# EAGLE design power_rev_2 (EAGLE 6.3)
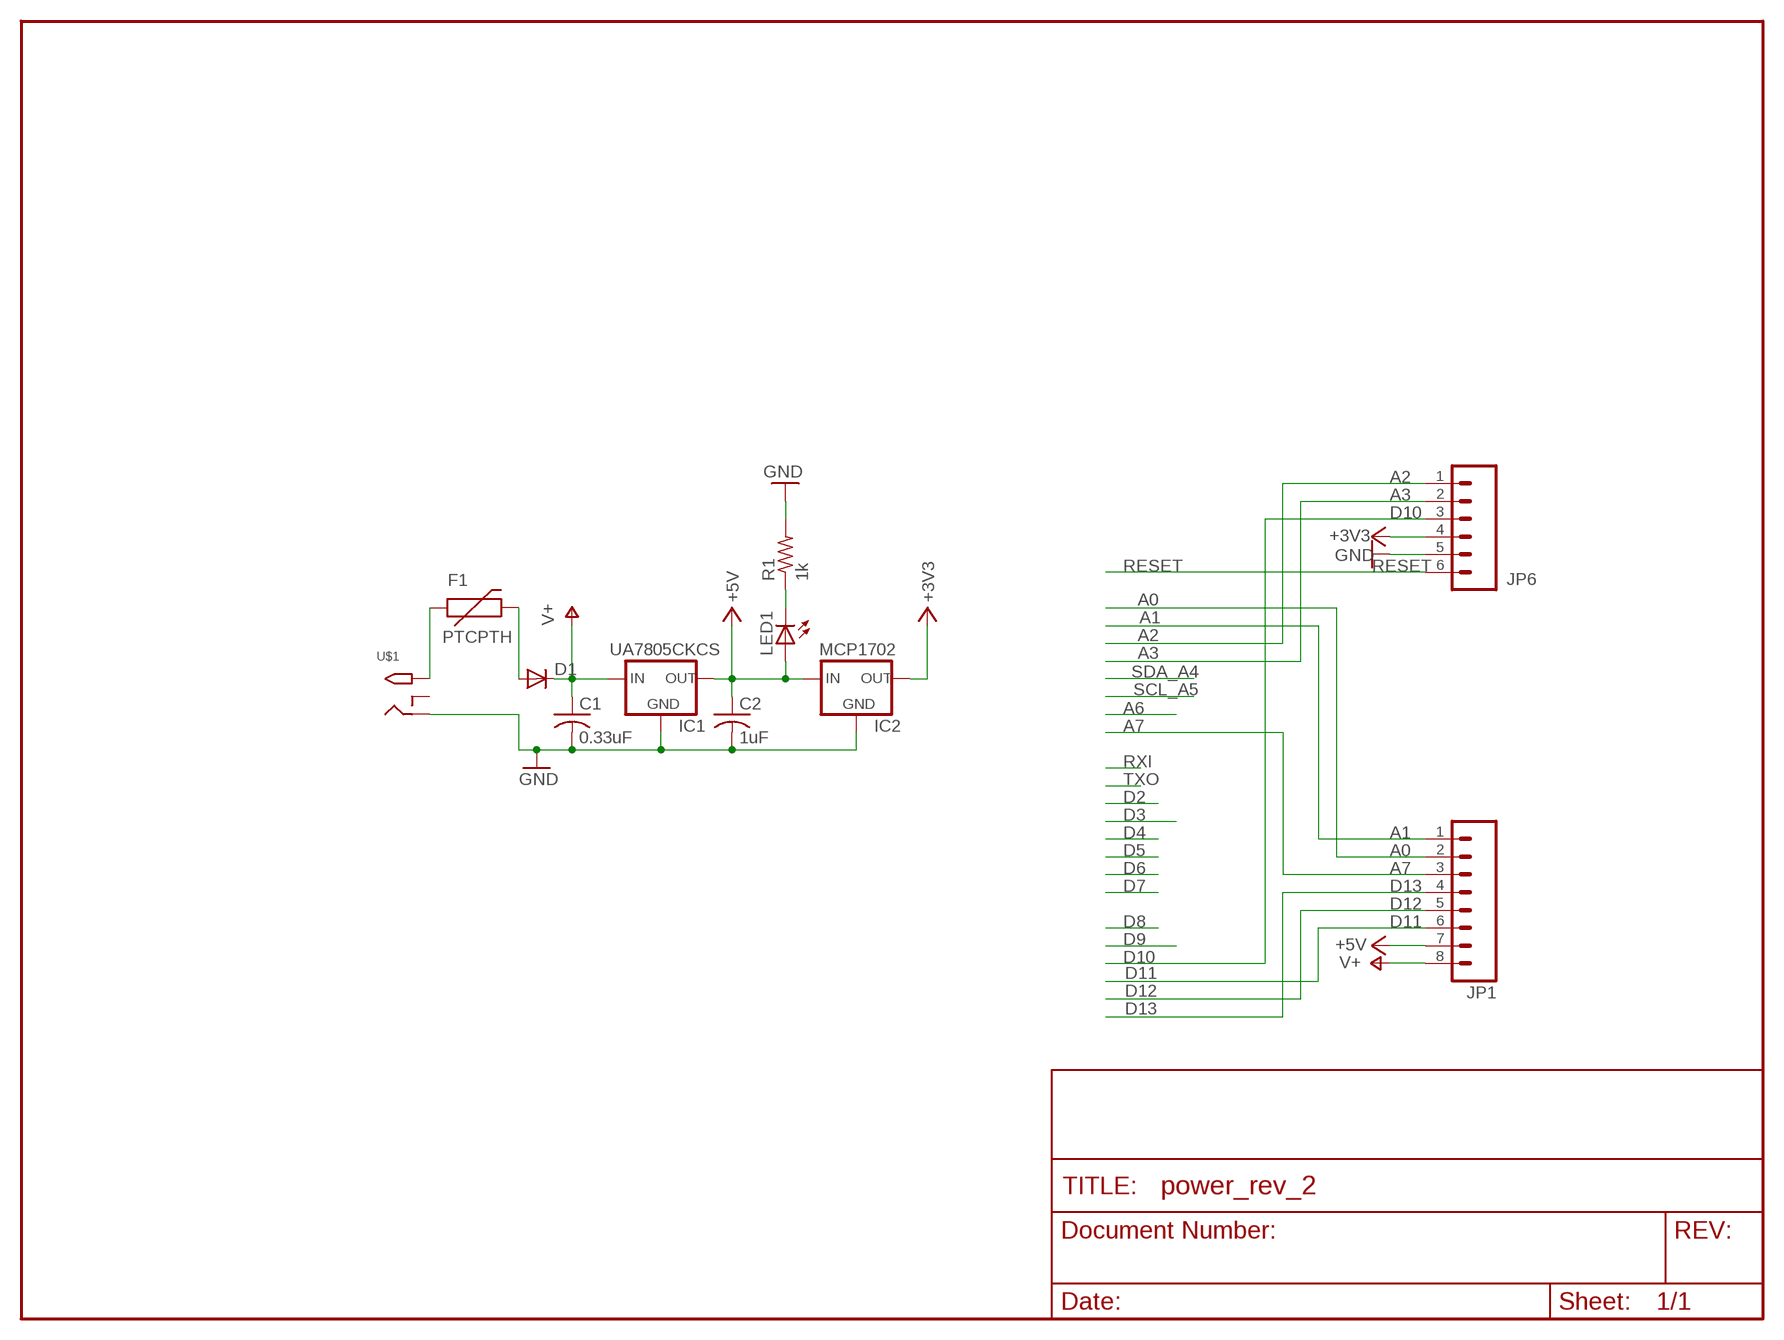
[diagram p0: schematic, sheet 1]

## Parts
C1  0.33uF  C-US025-024X044  [C025-024X044]
C2  1uF  C-US025-024X044  [C025-024X044]
D1  DIODE1N4148  [DIODE-1N4148]
F1  PTCPTH  [PTC]
IC1  UA7805CKCS  V_REG_78XX-TO-220  [TO-220-ALT]
IC2  MCP1702  MCP1700INLINE  [TO92-INLINE]
JP1  M081X08  [1X08]
JP6  M06SIP  [1X06]
LED1  LED3MM  [LED3MM]
R1  1k  R-US_0204/5  [0204/5]
U$1  2.1MMJACKTHM  [PJ-102A]

## Nets
+3V3: IC2.3(OUT) JP6.4
+5V: C2.1 IC1.OUT IC2.2(IN) JP1.7 LED1.A
A0: JP1.2
A1: JP1.1
A2: JP6.1
A3: JP6.2
A7: JP1.3
D10: JP6.3
D11: JP1.6
D12: JP1.5
D13: JP1.4
GND: C1.2 C2.2 IC1.GND IC2.1(GND) JP6.5 R1.2 U$1.RING
N$1: F1.P$1 U$1.TIP
N$2: LED1.K(C) R1.1
N$3: D1.A F1.P$2
RESET: JP6.6
V+: C1.1 D1.C IC1.IN JP1.8
Unconnected: U$1.RING_SW

## Library data of the parts
C1 C2 = adafruit:C-US: CAPACITOR, American symbol
D1 = SparkFun:DIODE: Diode These are standard reverse protection diodes and small signal diodes. SMA package can handle up to about 1A. SOD-323 can handle about 200mA. What the SOD-323 package when ordering, there are some mfgs out there that are 5-pin packages.
F1 = SparkFun_mod:PTC: Resettable Fuse PTC Resettable Fuse. Spark Fun Electronics SKU : COM-08357
IC1 = SparkFun:V_REG_78XX: Voltage Regulator Standard 7805 5V regulator. IGO (Input Ground Output). Spark Fun Electronics SKU : COM-00107
IC2 = adafruit:MCP1700: VOLTAGE REGULATOR
JP1 = SparkFun:M08: Header 8 Standard 8-pin 0.1" header. Use with straight break away headers (SKU : PRT-00116), right angle break away headers (PRT-00553), swiss pins (PRT-00743), machine pins (PRT-00117), and female headers (PRT-00115).
JP6 = SparkFun:M06: Header 6 Standard 6-pin 0.1" header. Use with straight break away headers (SKU : PRT-00116), right angle break away headers (PRT-00553), swiss pins (PRT-00743), machine pins (PRT-00117), and female headers (PRT-00115). Molex polarized connector foot print use with SKU : PRT-08094 with associated crimp pins and housings. NOTES ON THE VARIANTS LOCK and LOCK_LONGPADS... This footprint was designed to help hold the alignment of a through-hole component (i.e. 6-pin header) while soldering it into place. You may notice that each hole has been shifted either up or down by 0.005 of an inch from it's more standard position (which is a perfectly straight line). This slight alteration caused the pins (the squares in the middle) to touch the edges of the holes. Because they are alternating, it causes a "brace" to hold the component in place. 0.005 has proven to be the perfect amount of "off-center" position when using our standard breakaway headers. Although looks a little odd when you look at the bare footprint, once you have a header in there, the alteration is very hard to notice. Also, if you push a header all the way into place, it is covered up entirely on the bottom side. This idea of altering the position of holes to aid alignment will be further integrated into the Sparkfun Library for other footprints. It can help hold any component with 3 or more connection pins.
LED1 = adafruit:LED: LED OSRAM: - CHIPLED LG R971, LG N971, LY N971, LG Q971, LY Q971, LO R971, LY R971 LH N974, LH R974 LS Q976, LO Q976, LY Q976 LO Q996 - Hyper CHIPLED LW Q18S LB Q993, LB Q99A, LB R99A - SideLED LS A670, LO A670, LY A670, LG A670, LP A670 LB A673, LV A673, LT A673, LW A673 LH A674 LY A675 LS A676, LA A676, LO A676, LY A676, LW A676 LS A679, LY A679, LG A679 - Hyper Micro SIDELED® LS Y876, LA Y876, LO Y876, LY Y876 LT Y87S - SmartLED LW L88C, LW L88S LB L89C, LB L89S, LG L890 LS L89K, LO L89K, LY L89K LS L896, LA L896, LO L896, LY L896 - TOPLED LS T670, LO T670, LY T670, LG T670, LP T670 LSG T670, LSP T670, LSY T670, LOP T670, LYG T670 LG T671, LOG T671, LSG T671 LB T673, LV T673, LT T673, LW T673 LH T674 LS T676, LA T676, LO T676, LY T676, LB T676, LH T676, LSB T676, LW T676 LB T67C, LV T67C, LT T67C, LS T67K, LO T67K, LY T67K, LW E67C LS E67B, LA E67B, LO E67B, LY E67B, LB E67C, LV E67C, LT E67C LW T67C LS T679, LY T679, LG T679 LS T770, LO T770, LY T770, LG T770, LP T770 LB T773, LV T773, LT T773, LW T773 LH T774 LS E675, LA E675, LY E675, LS T675 LS T776, LA T776, LO T776, LY T776, LB T776 LHGB T686 LT T68C, LB T68C - Hyper Mini TOPLED® LB M676 - Mini TOPLED Santana® LG M470 LS M47K, LO M47K, LY M47K Source: http://www.osram.convergy.de/
R1 = adafruit:R-US_: RESISTOR, American symbol
U$1 = adafruit:2.1MMJACK: 2.1mm x 5.5mm THM DC jack with internal switch. Digikey part #PJ-102A, 4UCON part #05537 2.1mm x 5.5mm SMT DC jack with internal switch. Digikey part #PJ-002A-SMT, 4UCON part #03267 By microbuilder.eu & adafruit.com

## Net classes
0 default: width 0.203 mm
1 vcc: width 0.254 mm

## Board
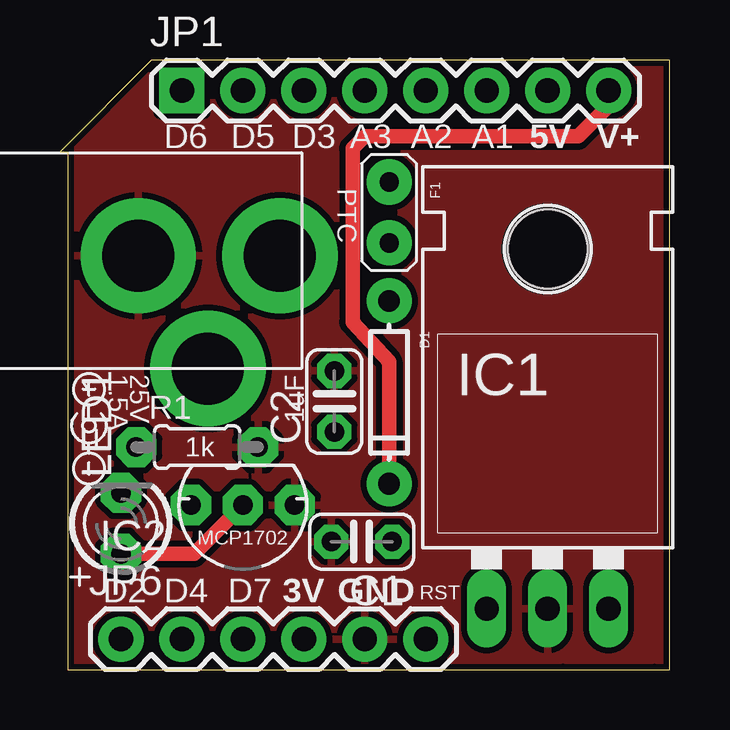
[diagram p1: board, top side]
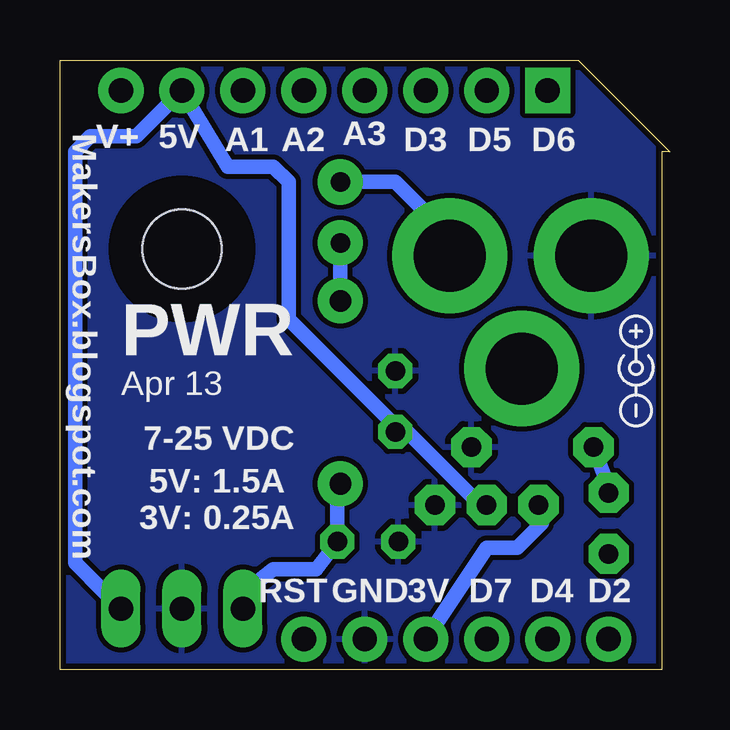
[diagram p2: board, bottom side, seen from below]

Size 25.4 x 25.4 mm. Coordinates in mm from the lower left corner, seen from the top.
Outline: 25.4,25.4 25.4,21.59 25.4,0 24.77,0 20.96,0 0.32,0 0.32,21.59 0,21.59 3.81,25.4 25.4,25.4
Copper layers (1*16): Top 0.035mm / dielectric 1.5mm / Bottom 0.035mm
Design rules "SparkFun": minimum track width 8mil, minimum drill 20mil, track to track 8mil, track to pad 8mil, pad to pad 8mil, via to via 8mil, smd to smd 8mil, copper to edge 10mil, drill to drill 8mil, minimum pad ring 12mil, minimum via ring 10mil, stop-mask expansion 4mil, vias tented up to drill 25mil, thermal gap 10mil

### Footprints (pad centres in the part's own frame; a part is rotated, then mirrored left to right if it is on the bottom)
C025-024X044 = drill 0.813 pad 1.422 octagon: 1 -1.27,0; 2 1.27,0
DIODE-1N4148 = drill 0.9 pad 1.88: A -3.81,0; C 3.81,0
PTC = drill 0.8 pad 1.88: P$1 -1.27,0; P$2 1.27,0
TO-220-ALT = drill 1.016 long: GND 0,-3.81; IN -2.54,-3.81; OUT 2.54,-3.81 | hole 3.302: 0,11.176
TO92-INLINE = drill 0.813 pad 1.676 octagon: 1 -2.159,0; 2 0,0; 3 2.159,0
1X08 = drill 1.016 pad 1.88 square: 1 0,0 | drill 1.016 pad 1.88: 2 2.54,0; 3 5.08,0; 4 7.62,0; 5 10.16,0; 6 12.7,0; 7 15.24,0; 8 17.78,0
1X06 = drill 1.016 pad 1.88: 1 0,0; 2 2.54,0; 3 5.08,0; 4 7.62,0; 5 10.16,0; 6 12.7,0
LED3MM = drill 0.813 pad 1.676 octagon: A -1.27,0; K 1.27,0
0204/5 = drill 0.813 pad 1.676 octagon: 1 -2.54,0; 2 2.54,0
PJ-102A = drill 3 pad 4.8: RING 0.1,-3.39; RING_SW -4.6,-6.29; TIP 0.1,-9.29

### Placement (x,y rotation side)
C1  12.57,5.33 180 top
C2  11.43,11.18 90 top
D1  13.72,11.56 270 top
F1  13.72,19.05 270 top
IC1  20.32,6.35 0 top
IC2  7.62,6.86 180 top
JP1  5.08,24.13 0 top
JP6  2.54,1.27 0 top
LED1  2.54,6.1 90 top
R1  5.71,9.27 0 top
U$1  -0.13,17.14 90 top
U$2  [DC_POS_CTR]  1.21,10.16 90 top
U$3  [DC_POS_CTR-BOTTOM]  1.4,12.57 90 top

### Tracks (layer width: path | path; a pad name or v marks a point on that pad's centre or on a via)
+3V3
  Bottom 0.61: IC2.3 5.33,6.1 6.35,5.08 7.62,5.08 JP6.4
+5V
  Top 0.61: LED1.A 5.59,4.83 IC2.2
  Bottom 0.61: 24.13,3.81 IC1.OUT 24.76,4.45 24.76,21.59 24.13,22.23 22.22,22.23 JP1.7 18.41,20.95 16.51,20.95 15.87,20.32 15.87,14.61 11.43,10.16 C2.1 10.92,9.91 7.87,6.86 IC2.2
GND
  pour Bottom: -1.27,26.67 26.67,26.67 26.67,-1.27 -1.27,-1.27
  pour Top (isolate 0.254): -0.64,26.04 26.67,26.04 26.67,0 26.03,-0.64 -0.64,-0.64
N$1
  Bottom 0.61: U$1.TIP 9.16,18.05 11.43,20.32 F1.P$1
N$2
  Bottom 0.61: LED1.K 2.54,7.62 R1.1
N$3
  Bottom 0.61: F1.P$2 D1.A
V+
  Top 0.61: JP1.8 22.86,23.5 21.59,22.23 12.7,22.23 12.19,21.72 12.19,14.48 13.72,12.83 D1.C
  Bottom 0.61: IC1.IN 17.78,3.17 16.51,4.19 14.73,4.19 C1.1 13.84,7.49 D1.C

### Text on the board
tPlace: D6 | D5 | D3 | A3 | A2 | A1 | 5V | V+ | PTC | 1.5A | 25V | 1uF | 1k | MCP1702 | D2 | D4 | D7 | 3V | GND | RST
bPlace: D6 | D5 | D3 | A3 | A2 | 5V | V+ | A1 | MakersBox.blogspot.com | PWR | Apr 13 | 7-25 VDC | 5V: 1.5A | 3V: 0.25A | D2 | D4 | D7 | 3V | GND | RST